# EAGLE design attinier84-2digit-shield-mk-2.1 (EAGLE 6.5.0)
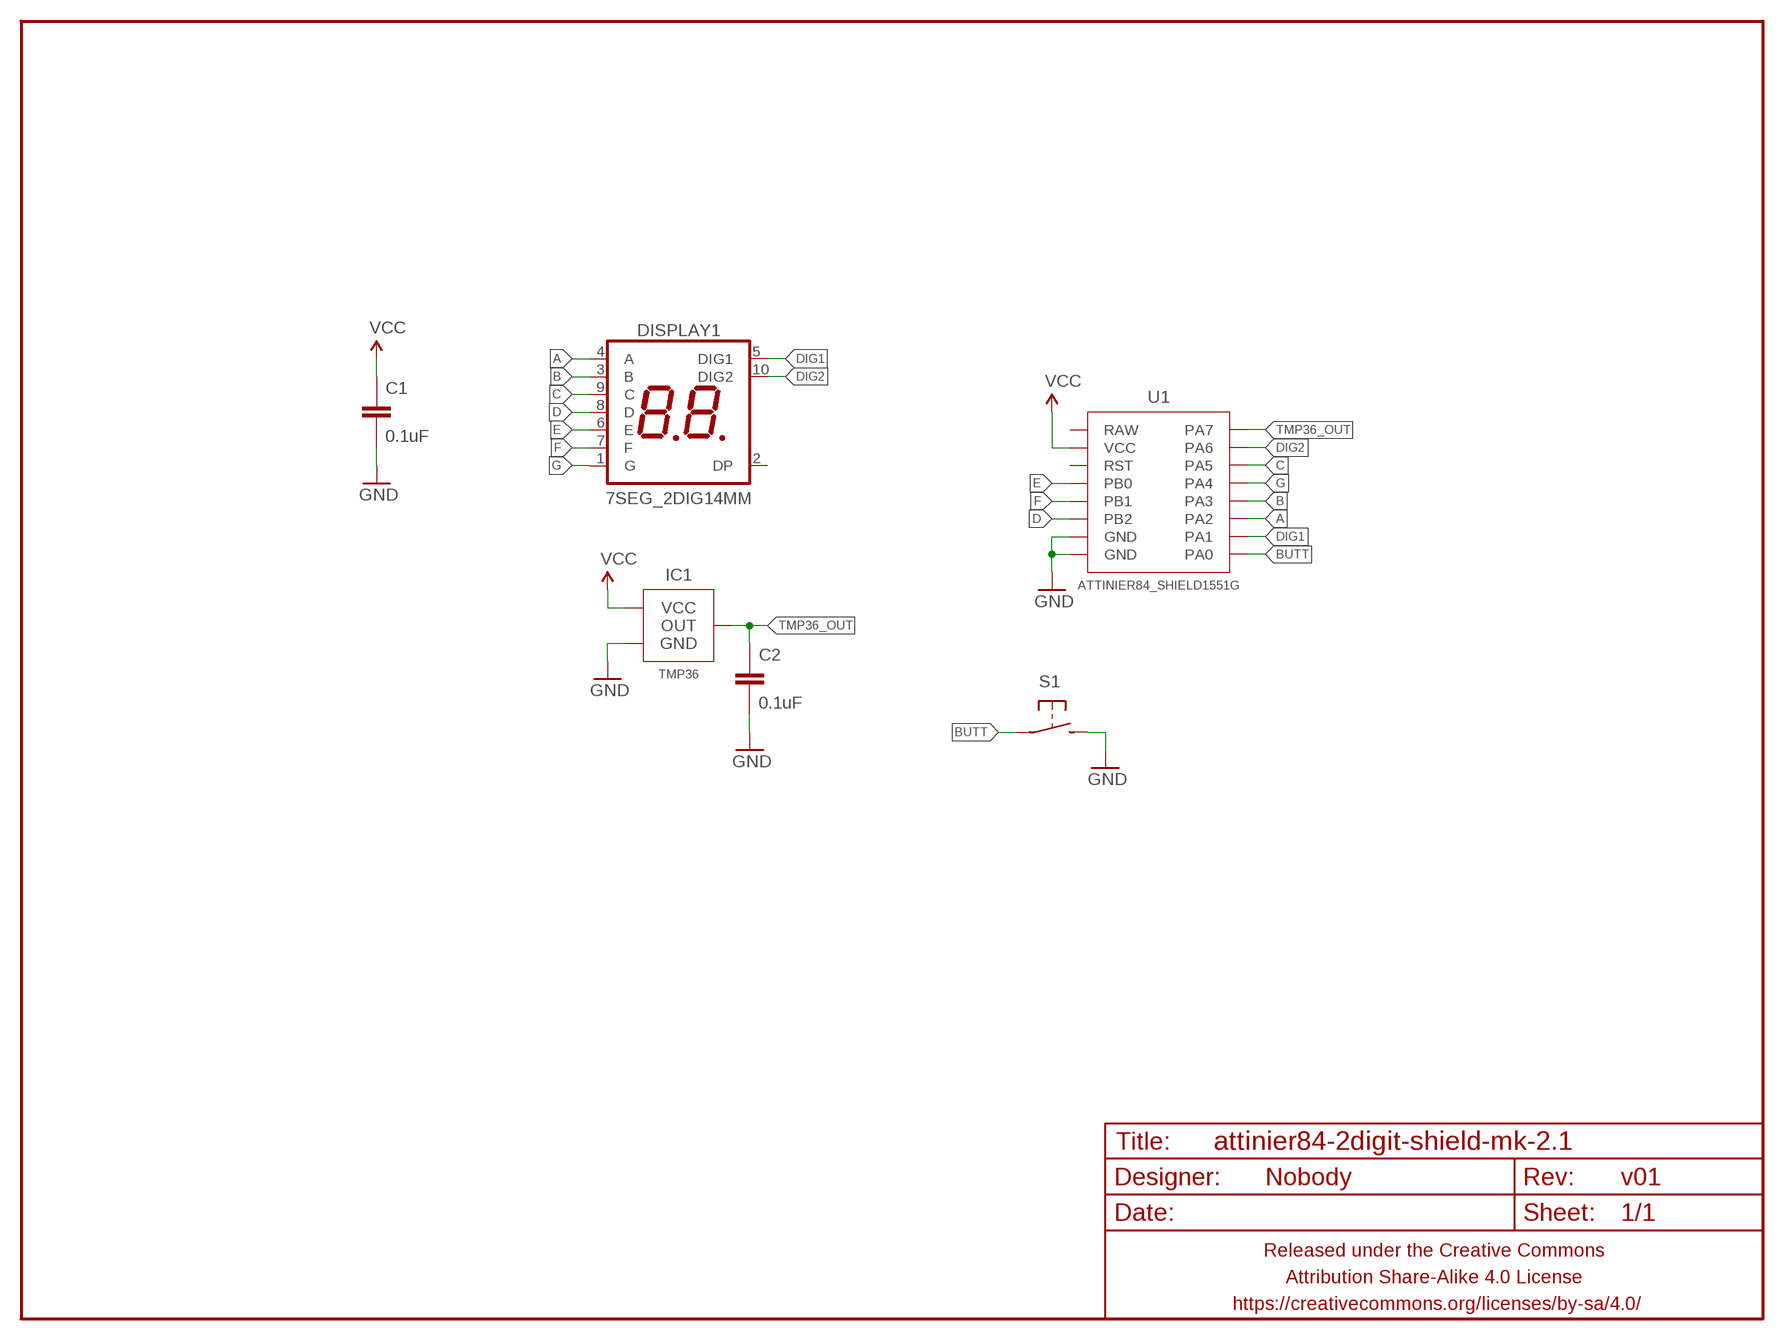
[diagram p0: schematic, sheet 1]

## Parts
C1  0.1uF  CAPACITOR-CERAMIC025-024X044  [C025-024X044]
C2  0.1uF  CAPACITOR-CERAMIC025-024X044  [C025-024X044]
DISPLAY1  7SEG_2DIG14MM  [7SEG_2DIG_14MM]
FRAME1  FRAME-LETTERNO_PACKAGE  [DUMMY]
IC1  TMP36  TMP36TO-92  [TO-92-AMMO]
S1  SPST-NO-TACT3MM-PTH-SMALL-PADS  [DTS-3-SMALL-PADS]
U1  ATTINIER84_SHIELD1551G  [ATTINIER84_SHIELD2]

## Nets
A: DISPLAY1.4(A) U1.PA2
B: DISPLAY1.3(B) U1.PA3
BUTT: S1.1 U1.PA0
C: DISPLAY1.9(C) U1.PA5
D: DISPLAY1.8(D) U1.PB2
DIG1: DISPLAY1.5(DIG1) U1.PA1
DIG2: DISPLAY1.10(DIG2) U1.PA6
E: DISPLAY1.6(E) U1.PB0
F: DISPLAY1.7(F) U1.PB1
G: DISPLAY1.1(G) U1.PA4
GND: C1.2 C2.2 IC1.3(GND) S1.2 U1.GND@1(GND) U1.GND@2(GND)
TMP36_OUT: C2.1 IC1.2(OUT) U1.PA7
VCC: C1.1 IC1.1(VCC) U1.VCC
Unconnected: DISPLAY1.2(DP) U1.RAW U1.RST

## Library data of the parts
C1 C2 = A_butts:CAPACITOR-CERAMIC: CAPACITOR, European symbol
DISPLAY1 = A_butts:7SEG_2DIG
FRAME1 = A_butts:FRAME-LETTER: Schematic Frame Standard 8.5x11 US Letter frame; DESIGNER: Nobody; VERSION: v01
IC1 = A_butts:TMP36
S1 = A_butts:SPST-NO-TACT
U1 = A_butts:ATTINIER84_SHIELD

## Board
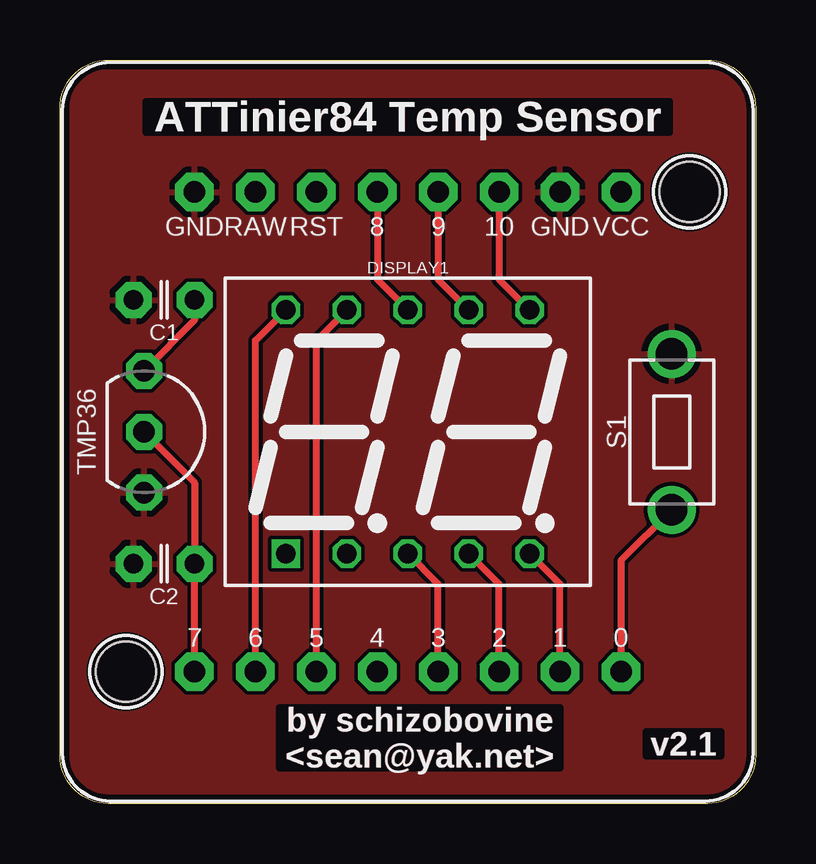
[diagram p1: board, top side]
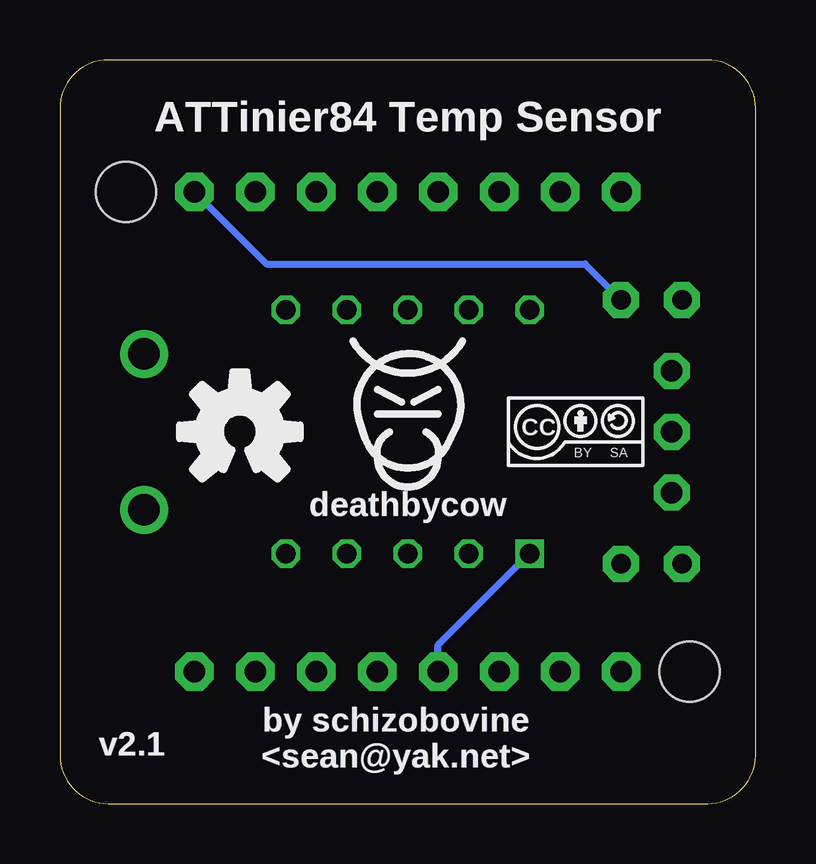
[diagram p2: board, bottom side, seen from below]

Size 29 x 31 mm. Coordinates in mm from the lower left corner, seen from the top.
Copper layers (1*16): Top 0.0356mm / dielectric 1.5011mm / Bottom 0.0356mm
Design rules "LaenPCBOrder_2": minimum track width 6mil, minimum drill 13mil, track to track 6mil, track to pad 6mil, pad to pad 6mil, via to via 6mil, smd to smd 6mil, copper to edge 15mil, drill to drill 6mil, minimum pad ring 7mil, minimum via ring 7mil, stop-mask expansion 3mil, vias tented up to drill 20mil, thermal gap 10mil

### Footprints (pad centres in the part's own frame; a part is rotated, then mirrored left to right if it is on the bottom)
C025-024X044 = drill 0.813 pad 1.5 octagon: 1 -1.27,0; 2 1.27,0
7SEG_2DIG_14MM = drill 0.8 square: 1 -5.08,-5.08 | drill 0.8 octagon: 2 -2.54,-5.08; 3 0,-5.08; 4 2.54,-5.08; 5 5.08,-5.08; 6 5.08,5.08; 7 2.54,5.08; 8 0,5.08; 9 -2.54,5.08; 10 -5.08,5.08
TO-92-AMMO = drill 0.9 pad 1.5 octagon: 1 -2.54,0; 2 0,0; 3 2.54,0
DTS-3-SMALL-PADS = drill 1.3 pad 2: 1 -3.25,0; 2 3.25,0
ATTINIER84_SHIELD2 = drill 0.9 pad 1.6 octagon: GND@1 10,-6.35; GND@2 10,8.89; PA0 -10,-8.89; PA1 -10,-6.35; PA2 -10,-3.81; PA3 -10,-1.27; PA4 -10,1.27; PA5 -10,3.81; PA6 -10,6.35; PA7 -10,8.89; PB0 10,-3.81; PB1 10,-1.27; PB2 10,1.27; RAW 10,6.35; RST 10,3.81; VCC 10,-8.89 | hole 2.5: -10,11.75; 10,-11.75

### Placement (x,y rotation side)
C1  4.34,21 180 top
C2  4.34,10 180 top
DISPLAY1  14.5,15.5 0 top
FRAME1  29,0 90 top
IC1  3.5,15.5 270 top
S1  25.5,15.5 90 top
U1  14.5,15.5 90 top
U$1  [CC-BY-SA-4.0-NO-URL]  7.5,15.5 0 bottom
U$2  [COW_SMALL_METAL]  14.5,16.75 0 bottom
U$3  [OSHWLOGO_BOT_0.2_A]  21.5,15.5 0 top

### Tracks (layer width: path | path; a pad name or v marks a point on that pad's centre or on a via)
A
  Top 0.3: U1.PA2 18.31,9.15 DISPLAY1.4
B
  Top 0.3: U1.PA3 15.77,9.15 DISPLAY1.3
BUTT
  Top 0.3: S1.1 23.39,10.14 U1.PA0
C
  Top 0.3: U1.PA5 10.69,19.31 DISPLAY1.9
D
  Top 0.3: U1.PB2 13.23,21.85 DISPLAY1.8
DIG1
  Top 0.3: U1.PA1 20.85,9.15 DISPLAY1.5
DIG2
  Top 0.3: U1.PA6 8.15,19.31 DISPLAY1.10
E
  Top 0.3: U1.PB0 18.31,21.85 DISPLAY1.6
F
  Top 0.3: U1.PB1 15.77,21.85 DISPLAY1.7
G
  Bottom 0.3: U1.PA4 13.23,6.61 DISPLAY1.1
GND
  pour Top: 29.1,-0.1 -0.1,-0.1 -0.1,31.1 29.1,31.1
TMP36_OUT
  Top 0.3: IC1.2 5.61,13.39 C2.1 U1.PA7
VCC
  Top 0.3: C1.1 5.61,20.15 IC1.1
  Bottom 0.3: U1.VCC 20.39,22.5 7.11,22.5 C1.1

### Text on the board
Top: ATTinier84 Temp Sensor | by schizobovine / <sean@yak.net>
Bottom: ATTinier84 Temp Sensor | by schizobovine / <sean@yak.net>
tPlace: ATTinier84 Temp Sensor | by schizobovine / <sean@yak.net>
bPlace: ATTinier84 Temp Sensor | by schizobovine / <sean@yak.net>